# EAGLE design Principal (EAGLE 6.2)
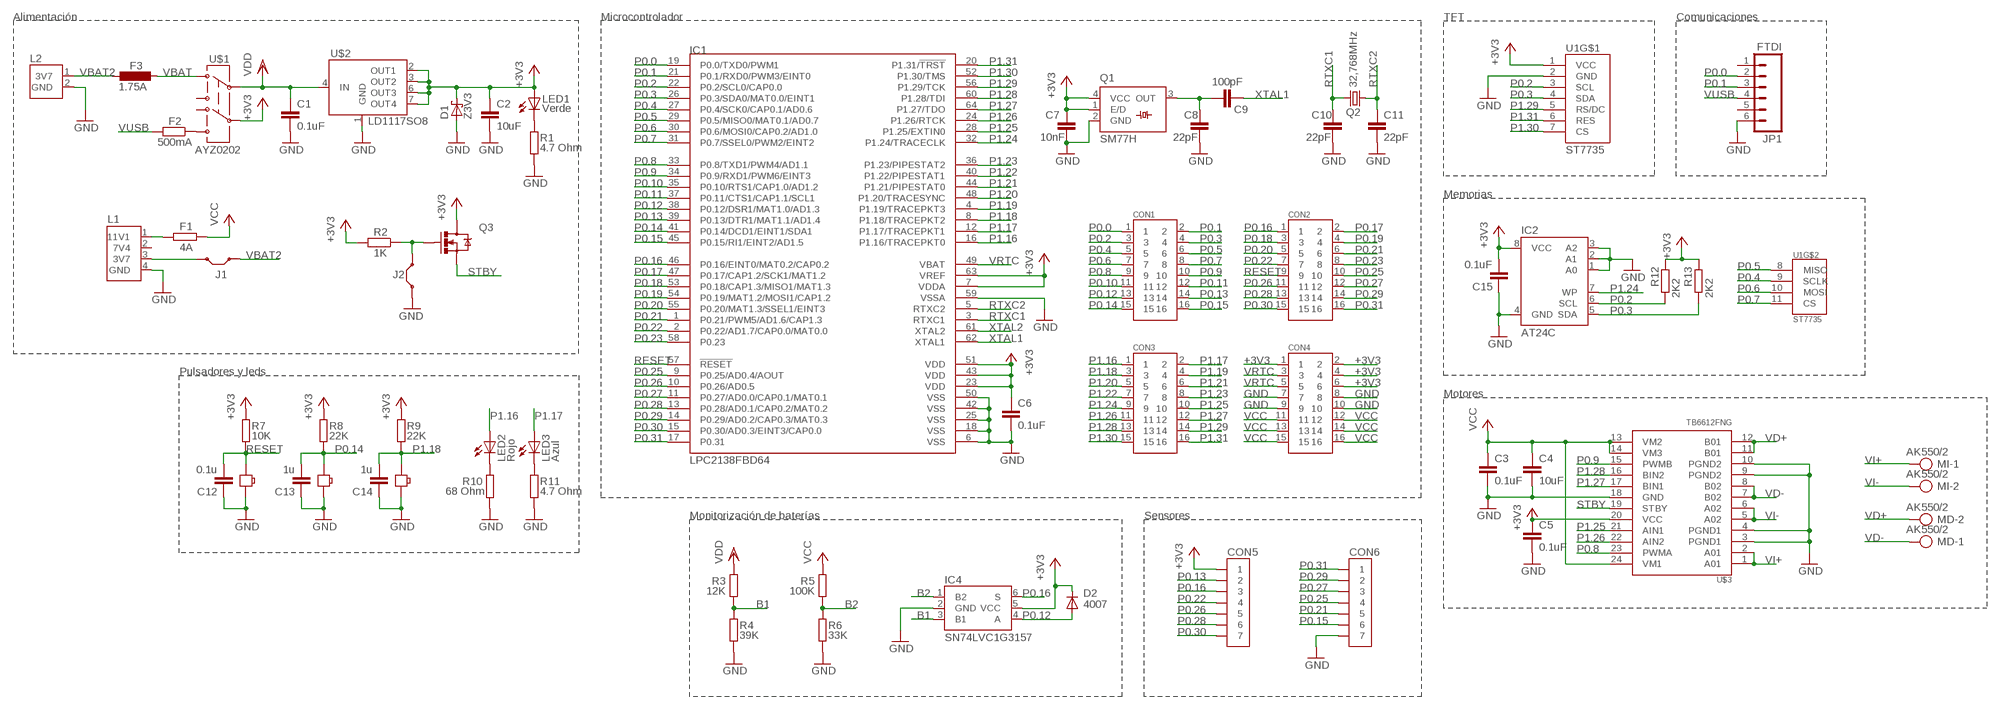
[diagram p0: schematic, sheet 1]

## Parts
B1  BUTTON-SMD-2P  [BUTTON_2P_SMD]
C1  0.1uF  C-EUC0805  [C0805]
C2  10uF  C-EUC1206  [C1206]
C3  0.1uF  C-EUC0805  [C0805]
C4  10uF  C-EUC1206  [C1206]
C5  0.1uF  C-EUC0805  [C0805]
C6  0.1uF  C-EUC0805  [C0805]
C7  10nF  C-EUC0805  [C0805]
C8  22pF  C-EUC0805  [C0805]
C9  100pF  C-EUC0805  [C0805]
C10  22pF  C-EUC0805  [C0805]
C11  22pF  C-EUC0805  [C0805]
C12  0.1u  C-EUC0805  [C0805]
C13  1u  C-EUC0805  [C0805]
C14  1u  C-EUC0805  [C0805]
C15  0.1uF  C-EUC0805  [C0805]
CON1  8X2_PIN_2MM_HEMBRA  [8X2_PIN_2MM]
CON2  8X2_PIN_2MM_HEMBRA  [8X2_PIN_2MM]
CON3  8X2_PIN_2MM_HEMBRA  [8X2_PIN_2MM]
CON4  8X2_PIN_2MM_HEMBRA  [8X2_PIN_2MM]
CON5  7_PINES  [7_PIN_MACHO_SMD_RA]
CON6  7_PINES  [7_PIN_MACHO_SMD_RA]
D1  Z3V3  SCHOTTKY-DIODEDO35-7  [DO35-7]
D2  4007  DIODE-SOD106-R  [SOD106-R]
F1  4A  FUSIBLE  [2920]
F2  500mA  R-EU_M1206  [M1206]
F3  1.75A  L-EUL1812  [L1812]
IC1  LPC2138FBD64  [TSQFP50P1200X1200X160-64N]
IC2  AT24C  [8S1]
IC4  SN74LVC1G3157  [DBV]
J1  JUMPERSMD  [2_PIN_VERT_SMD]
J2  JUMPERSMD  [2_PIN_VERT_SMD]
JP1  FTDI  M06SMD-STRAIGHT  [1X06_SMD_STRAIGHT]
L1  CONECTOR_LIPO_11.1V  [CONECTOR_LIPO_11.1V]
L2  CONECTOR_LIPO_3.7V  [CONECTOR_LIPO_3.7V]
LED1  Verde  LEDCHIPLED_0805  [CHIPLED_0805]
LED2  Rojo  LEDCHIPLED_0805  [CHIPLED_0805]
LED3  Azul  LEDCHIPLED_0805  [CHIPLED_0805]
LOAD  BUTTON-SMD-2P  [BUTTON_2P_SMD]
MD  AK550/2  [AK550/2]
MI  AK550/2  [AK550/2]
Q1  SM77H  [SM77H]
Q2  32,768MHz  CRYSTALTC38H  [TC38H]
Q3  MOSFET-NCHANNELSMD  [SOT23-3]
R1  4.7 Ohm  R-EU_R0805  [R0805]
R2  1K  R-EU_R0805  [R0805]
R3  12K  R-EU_R0805  [R0805]
R4  39K  R-EU_R0805  [R0805]
R5  100K  R-EU_R0805  [R0805]
R6  33K  R-EU_R0805  [R0805]
R7  10K  R-EU_R0805  [R0805]
R8  22K  R-EU_R0805  [R0805]
R9  22K  R-EU_R0805  [R0805]
R10  68 Ohm  R-EU_R0805  [R0805]
R11  4.7 Ohm  R-EU_R0805  [R0805]
R12  2K2  R-EU_R0805  [R0805]
R13  2K2  R-EU_R0805  [R0805]
RESET  BUTTON-SMD-2P  [BUTTON_2P_SMD]
U1  ST7735  [ST7735]
U$1  AYZ0202  [AYZ0202]
U$2  LD1117SO8  [SO8]
U$3  TB6612FNG  [SSOP24]

## Nets
+3V3: C2.1 C5.1 C6.1 C7.1 C15.2 CON4.1 CON4.2 CON4.4 CON4.6 CON5.P$1 D1.C D2.C IC1.7(VDDA) IC1.23(VDD) IC1.43(VDD) IC1.51(VDD) IC1.63(VREF) IC2.8(VCC) IC4.5(VCC) LED1.A Q1.1(E/D) Q1.4(VCC) Q3.3(D) R2.2 R7.2 R8.2 R9.2 R12.2 R13.2 U1.1(VCC) U$1.5 U$2.2(OUT1) U$2.3(OUT2) U$2.6(OUT3) U$2.7(OUT4) U$3.20(VCC)
B1: IC4.3(B1) R3.1 R4.2
B2: IC4.1(B2) R5.1 R6.2
GND [gnd]: B1.P$2 C1.2 C2.2 C3.2 C4.2 C5.2 C6.2 C7.2 C8.2 C10.2 C11.2 C12.1 C13.1 C14.1 C15.1 CON4.7 CON4.8 CON4.9 CON4.10 CON6.P$7 D1.A IC1.6(VSS) IC1.18(VSS) IC1.25(VSS) IC1.42(VSS) IC1.50(VSS) IC1.59(VSSA) IC2.1(A0) IC2.2(A1) IC2.3(A2) IC2.4(GND) IC4.2(GND) J2.1 JP1.6 L1.4(GND) L2.2(GND) LOAD.P$2 Q1.2(GND) R1.2 R4.1 R6.1 R10.2 R11.2 RESET.P$2 U1.2(GND) U$2.1(GND) U$3.3(PGND1) U$3.4(PGND1) U$3.9(PGND2) U$3.10(PGND2) U$3.18(GND)
N$1: LED2.C R10.1
N$2: LED3.C R11.1
N$3: J2.2 Q3.1(G) R2.1
N$4: F2.1 U$1.4
N$5: F1.1 L1.1(11V1)
N$6: J1.2 L1.3(3V7)
N$9: LED1.C R1.1
N$17: C8.1 C9.1 Q1.3(OUT)
P0.0: CON1.1 IC1.19(P0.0/TXD0/PWM1) JP1.2
P0.1: CON1.2 IC1.21(P0.1/RXD0/PWM3/EINT0) JP1.3
P0.2: CON1.3 IC1.22(P0.2/SCL0/CAP0.0) IC2.6(SCL) R12.1 U1.3(SCL)
P0.3: CON1.4 IC1.26(P0.3/SDA0/MAT0.0/EINT1) IC2.5(SDA) R13.1 U1.4(SDA)
P0.4: CON1.5 IC1.27(P0.4/SCK0/CAP0.1/AD0.6) U1.9(SCLK)
P0.5: CON1.6 IC1.29(P0.5/MISO0/MAT0.1/AD0.7) U1.8(MISO)
P0.6: CON1.7 IC1.30(P0.6/MOSI0/CAP0.2/AD1.0) U1.10(MOSI)
P0.7: CON1.8 IC1.31(P0.7/SSEL0/PWM2/EINT2) U1.11(CS)
P0.8: CON1.9 IC1.33(P0.8/TXD1/PWM4/AD1.1) U$3.23(PWMA)
P0.9: CON1.10 IC1.34(P0.9/RXD1/PWM6/EINT3) U$3.15(PWMB)
P0.10: CON1.11 IC1.35(P0.10/RTS1/CAP1.0/AD1.2)
P0.11: CON1.12 IC1.37(P0.11/CTS1/CAP1.1/SCL1)
P0.12: CON1.13 D2.A IC1.38(P0.12/DSR1/MAT1.0/AD1.3) IC4.4(A)
P0.13: CON1.14 CON5.P$2 IC1.39(P0.13/DTR1/MAT1.1/AD1.4)
P0.14: C13.2 CON1.15 IC1.41(P0.14/DCD1/EINT1/SDA1) LOAD.1 R8.1
P0.15: CON1.16 CON6.P$6 IC1.45(P0.15/RI1/EINT2/AD1.5)
P0.16: CON2.1 CON5.P$3 IC1.46(P0.16/EINT0/MAT0.2/CAP0.2) IC4.6(S)
P0.17: CON2.2 IC1.47(P0.17/CAP1.2/SCK1/MAT1.2)
P0.18: CON2.3 IC1.53(P0.18/CAP1.3/MISO1/MAT1.3)
P0.19: CON2.4 IC1.54(P0.19/MAT1.2/MOSI1/CAP1.2)
P0.20: CON2.5 IC1.55(P0.20/MAT1.3/SSEL1/EINT3)
P0.21: CON2.6 CON6.P$5 IC1.1(P0.21/PWM5/AD1.6/CAP1.3)
P0.22: CON2.7 CON5.P$4 IC1.2(P0.22/AD1.7/CAP0.0/MAT0.0)
P0.23: CON2.8 IC1.58(P0.23)
P0.25: CON2.10 CON6.P$4 IC1.9(P0.25/AD0.4/AOUT)
P0.26: CON2.11 CON5.P$5 IC1.10(P0.26/AD0.5)
P0.27: CON2.12 CON6.P$3 IC1.11(P0.27/AD0.0/CAP0.1/MAT0.1)
P0.28: CON2.13 CON5.P$6 IC1.13(P0.28/AD0.1/CAP0.2/MAT0.2)
P0.29: CON2.14 CON6.P$2 IC1.14(P0.29/AD0.2/CAP0.3/MAT0.3)
P0.30: CON2.15 CON5.P$7 IC1.15(P0.30/AD0.3/EINT3/CAP0.0)
P0.31: CON2.16 CON6.P$1 IC1.17(P0.31)
P1.16: CON3.1 IC1.16(P1.16/TRACEPKT0) LED2.A
P1.17: CON3.2 IC1.12(P1.17/TRACEPKT1) LED3.A
P1.18: B1.1 C14.2 CON3.3 IC1.8(P1.18/TRACEPKT2) R9.1
P1.19: CON3.4 IC1.4(P1.19/TRACEPKT3)
P1.20: CON3.5 IC1.48(P1.20/TRACESYNC)
P1.21: CON3.6 IC1.44(P1.21/PIPESTAT0)
P1.22: CON3.7 IC1.40(P1.22/PIPESTAT1)
P1.23: CON3.8 IC1.36(P1.23/PIPESTAT2)
P1.24: CON3.9 IC1.32(P1.24/TRACECLK) IC2.7(WP)
P1.25: CON3.10 IC1.28(P1.25/EXTIN0) U$3.21(AIN1)
P1.26: CON3.11 IC1.24(P1.26/RTCK) U$3.22(AIN2)
P1.27: CON3.12 IC1.64(P1.27/TDO) U$3.17(BIN1)
P1.28: CON3.13 IC1.60(P1.28/TDI) U$3.16(BIN2)
P1.29: CON3.14 IC1.56(P1.29/TCK) U1.5(RS/DC)
P1.30: CON3.15 IC1.52(P1.30/TMS) U1.7(CS)
P1.31: CON3.16 IC1.20(P1.31/!TRST) U1.6(RES)
RESET: C12.2 CON2.9 IC1.57(!RESET) R7.1 RESET.1
RTXC1: C10.1 IC1.3(RTXC1) Q2.2
RTXC2: C11.1 IC1.5(RTXC2) Q2.1
STBY: Q3.2(S) U$3.19(STBY)
VBAT: F3.1 U$1.3
VBAT2: F3.2 J1.1 L2.1(3V7)
VCC: C3.1 C4.1 CON4.11 CON4.12 CON4.13 CON4.14 CON4.15 CON4.16 F1.2 R5.2 U$3.13(VM2) U$3.14(VM3) U$3.24(VM1)
VD+: MD.2 U$3.11(B01) U$3.12(B01)
VD-: MD.1 U$3.7(B02) U$3.8(B02)
VDD: C1.1 R3.2 U$1.2 U$2.4(IN)
VI+: MI.1 U$3.1(A01) U$3.2(A01)
VI-: MI.2 U$3.5(A02) U$3.6(A02)
VRTC: CON4.3 CON4.5 IC1.49(VBAT)
VUSB: F2.2 JP1.4
XTAL1: C9.2 IC1.62(XTAL1)
XTAL2: IC1.61(XTAL2)
Unconnected: JP1.1 JP1.5 U$1.1 U$1.6

## Notes on the sheet
- Alimentación | Microcontrolador | TFT | Comunicaciones
- Memorias
- Pulsadores y leds
- Motores
- Monitorización de baterías | Sensores

## Power pins joined to a net without a drawn wire
7V4: L1.2(7V4)

## Library data of the parts
B1 LOAD RESET = Itead_BP_110825:BUTTON-SMD-2P: BAS014
C1-C15 = resistor:C-EU: CAPACITOR, European symbol
CON1-CON4 = Robots:8X2_PIN_2MM_HEMBRA
CON5 CON6 = Robots:7_PINES
D1 = diode:SCHOTTKY-DIODE: Schottky Diode
D2 = diode:DIODE-: DIODE
F1 = Robots:FUSIBLE
F2 R1-R13 = resistor:R-EU_: RESISTOR, European symbol
F3 = resistor:L-EU: INDUCTOR, European symbol
IC1 = nxp:LPC2138
IC2 = atmel:AT24C*: 2-wire serial EEPROM
IC4 = Robots:SN74LVC1G3157
J1 J2 = Robots:JUMPER
JP1 = SparkFun:M06: Header 6 Standard 6-pin 0.1" header. Use with straight break away headers (SKU : PRT-00116), right angle break away headers (PRT-00553), swiss pins (PRT-00743), machine pins (PRT-00117), and female headers (PRT-00115). Molex polarized connector foot print use with SKU : PRT-08094 with associated crimp pins and housings. NOTES ON THE VARIANTS LOCK and LOCK_LONGPADS... This footprint was designed to help hold the alignment of a through-hole component (i.e. 6-pin header) while soldering it into place. You may notice that each hole has been shifted either up or down by 0.005 of an inch from it's more standard position (which is a perfectly straight line). This slight alteration caused the pins (the squares in the middle) to touch the edges of the holes. Because they are alternating, it causes a "brace" to hold the component in place. 0.005 has proven to be the perfect amount of "off-center" position when using our standard breakaway headers. Although looks a little odd when you look at the bare footprint, once you have a header in there, the alteration is very hard to notice. Also, if you push a header all the way into place, it is covered up entirely on the bottom side. This idea of altering the position of holes to aid alignment will be further integrated into the Sparkfun Library for other footprints. It can help hold any component with 3 or more connection pins.
L1 = Robots:CONECTOR_LIPO_11.1V
L2 = Robots:CONECTOR_LIPO_3.7V
LED1-LED3 = led:LED: LED OSRAM: - CHIPLED LG R971, LG N971, LY N971, LG Q971, LY Q971, LO R971, LY R971 LH N974, LH R974 LS Q976, LO Q976, LY Q976 LO Q996 - Hyper CHIPLED LW Q18S LB Q993, LB Q99A, LB R99A - SideLED LS A670, LO A670, LY A670, LG A670, LP A670 LB A673, LV A673, LT A673, LW A673 LH A674 LY A675 LS A676, LA A676, LO A676, LY A676, LW A676 LS A679, LY A679, LG A679 - Hyper Micro SIDELED® LS Y876, LA Y876, LO Y876, LY Y876 LT Y87S - SmartLED LW L88C, LW L88S LB L89C, LB L89S, LG L890 LS L89K, LO L89K, LY L89K LS L896, LA L896, LO L896, LY L896 - TOPLED LS T670, LO T670, LY T670, LG T670, LP T670 LSG T670, LSP T670, LSY T670, LOP T670, LYG T670 LG T671, LOG T671, LSG T671 LB T673, LV T673, LT T673, LW T673 LH T674 LS T676, LA T676, LO T676, LY T676, LB T676, LH T676, LSB T676, LW T676 LB T67C, LV T67C, LT T67C, LS T67K, LO T67K, LY T67K, LW E67C LS E67B, LA E67B, LO E67B, LY E67B, LB E67C, LV E67C, LT E67C LW T67C LS T679, LY T679, LG T679 LS T770, LO T770, LY T770, LG T770, LP T770 LB T773, LV T773, LT T773, LW T773 LH T774 LS E675, LA E675, LY E675, LS T675 LS T776, LA T776, LO T776, LY T776, LB T776 LHGB T686 LT T68C, LB T68C - Hyper Mini TOPLED® LB M676 - Mini TOPLED Santana® LG M470 LS M47K, LO M47K, LY M47K Source: http://www.osram.convergy.de LUXEON: - LUMILED® LXK2-PW12-R00, LXK2-PW12-S00, LXK2-PW14-U00, LXK2-PW14-V00 LXK2-PM12-R00, LXK2-PM12-S00, LXK2-PM14-U00 LXK2-PE12-Q00, LXK2-PE12-R00, LXK2-PE12-S00, LXK2-PE14-T00, LXK2-PE14-U00 LXK2-PB12-K00, LXK2-PB12-L00, LXK2-PB12-M00, LXK2-PB14-N00, LXK2-PB14-P00, LXK2-PB14-Q00 LXK2-PR12-L00, LXK2-PR12-M00, LXK2-PR14-Q00, LXK2-PR14-R00 LXK2-PD12-Q00, LXK2-PD12-R00, LXK2-PD12-S00 LXK2-PH12-R00, LXK2-PH12-S00 LXK2-PL12-P00, LXK2-PL12-Q00, LXK2-PL12-R00 Source: www.luxeon.com KINGBRIGHT: KA-3528ASYC Source: www.kingbright.com
MD MI = con-ptr500:AK550/2: CONNECTOR; OC_FARNELL: unknown; OC_NEWARK: unknown
Q1 = crystal:SM77H: 3.3V CMOS Clock Oscillator Source: www.pletronics.com .. sm77h%203.3v.pdf; OC_FARNELL: unknown; OC_NEWARK: unknown
Q2 = crystal:CRYSTAL: CRYSTAL; OC_FARNELL: unknown; OC_NEWARK: unknown
Q3 = SparkFun:MOSFET-NCHANNEL
U1 = Robots:ST7735
U$1 = SparkFun:AYZ0202: SPDT Slide Switch Simple SMD single-pull double-throw slide switch. Good for less than 350mA power switch, switching UARTs between devices, etc. Spark Fun Electronics SKU : COM-00597
U$2 = Robots:LD1117SO8
U$3 = SparkFun:TB6612FNG: Toshiba 1A motor driver

## Board
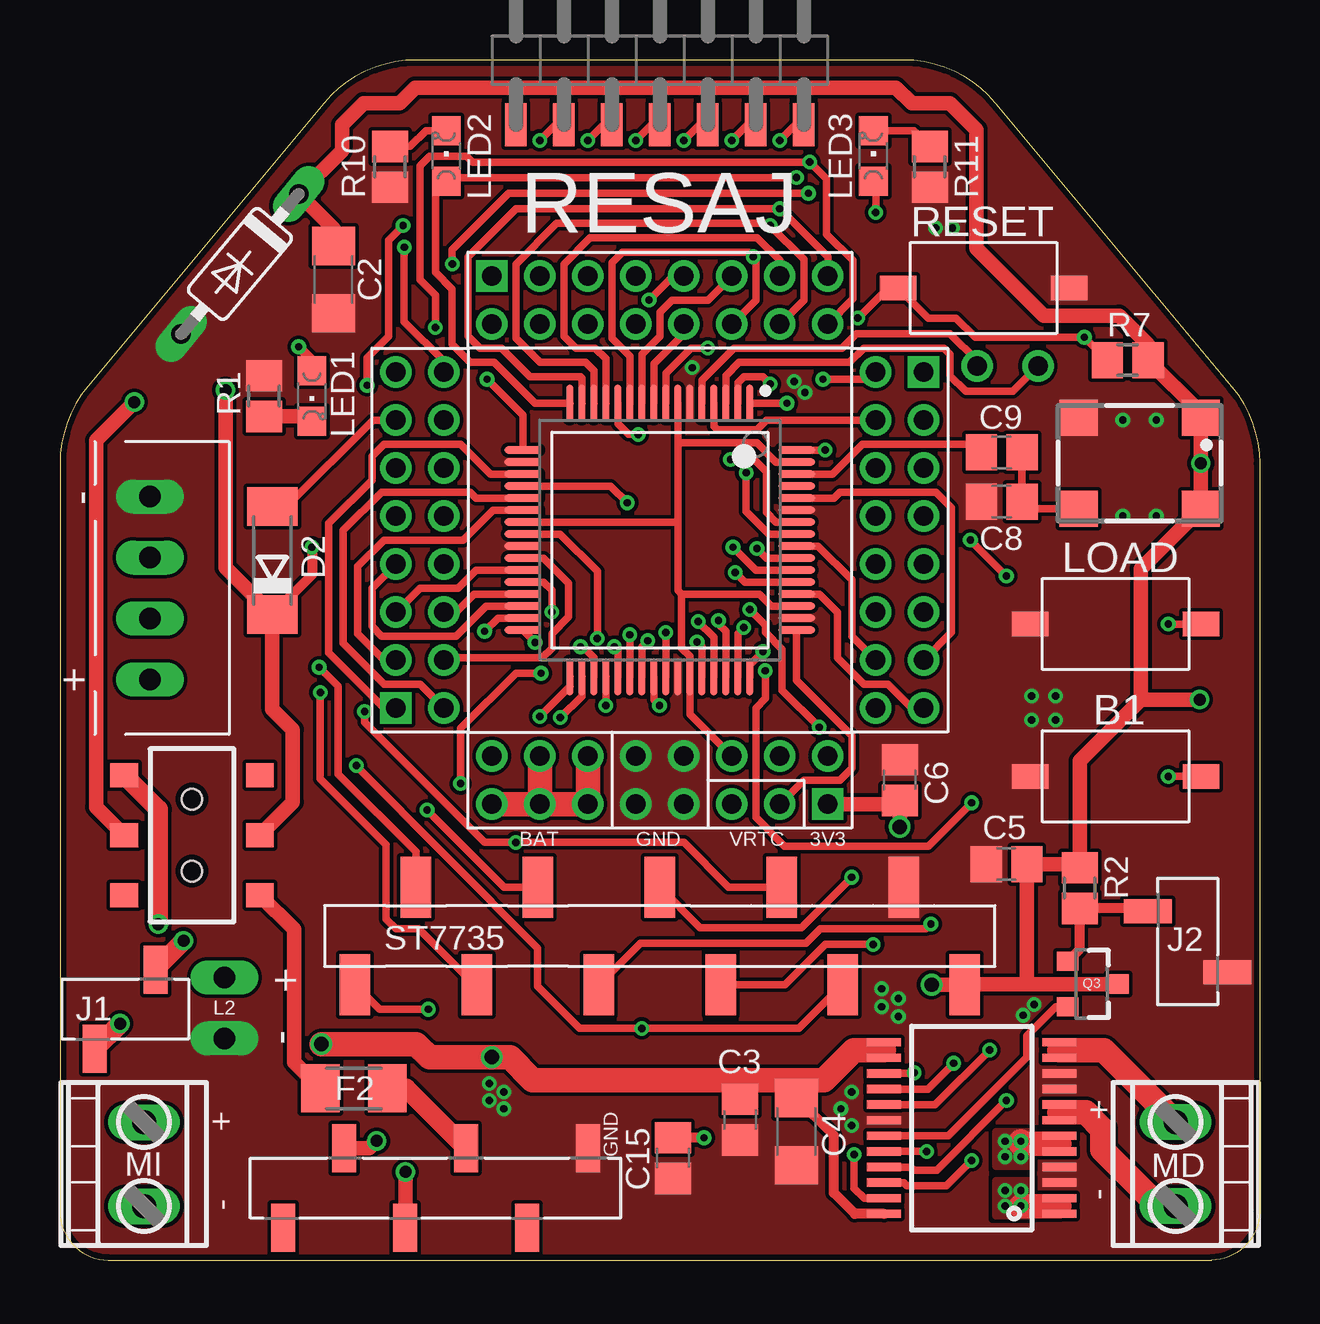
[diagram p1: board, top side]
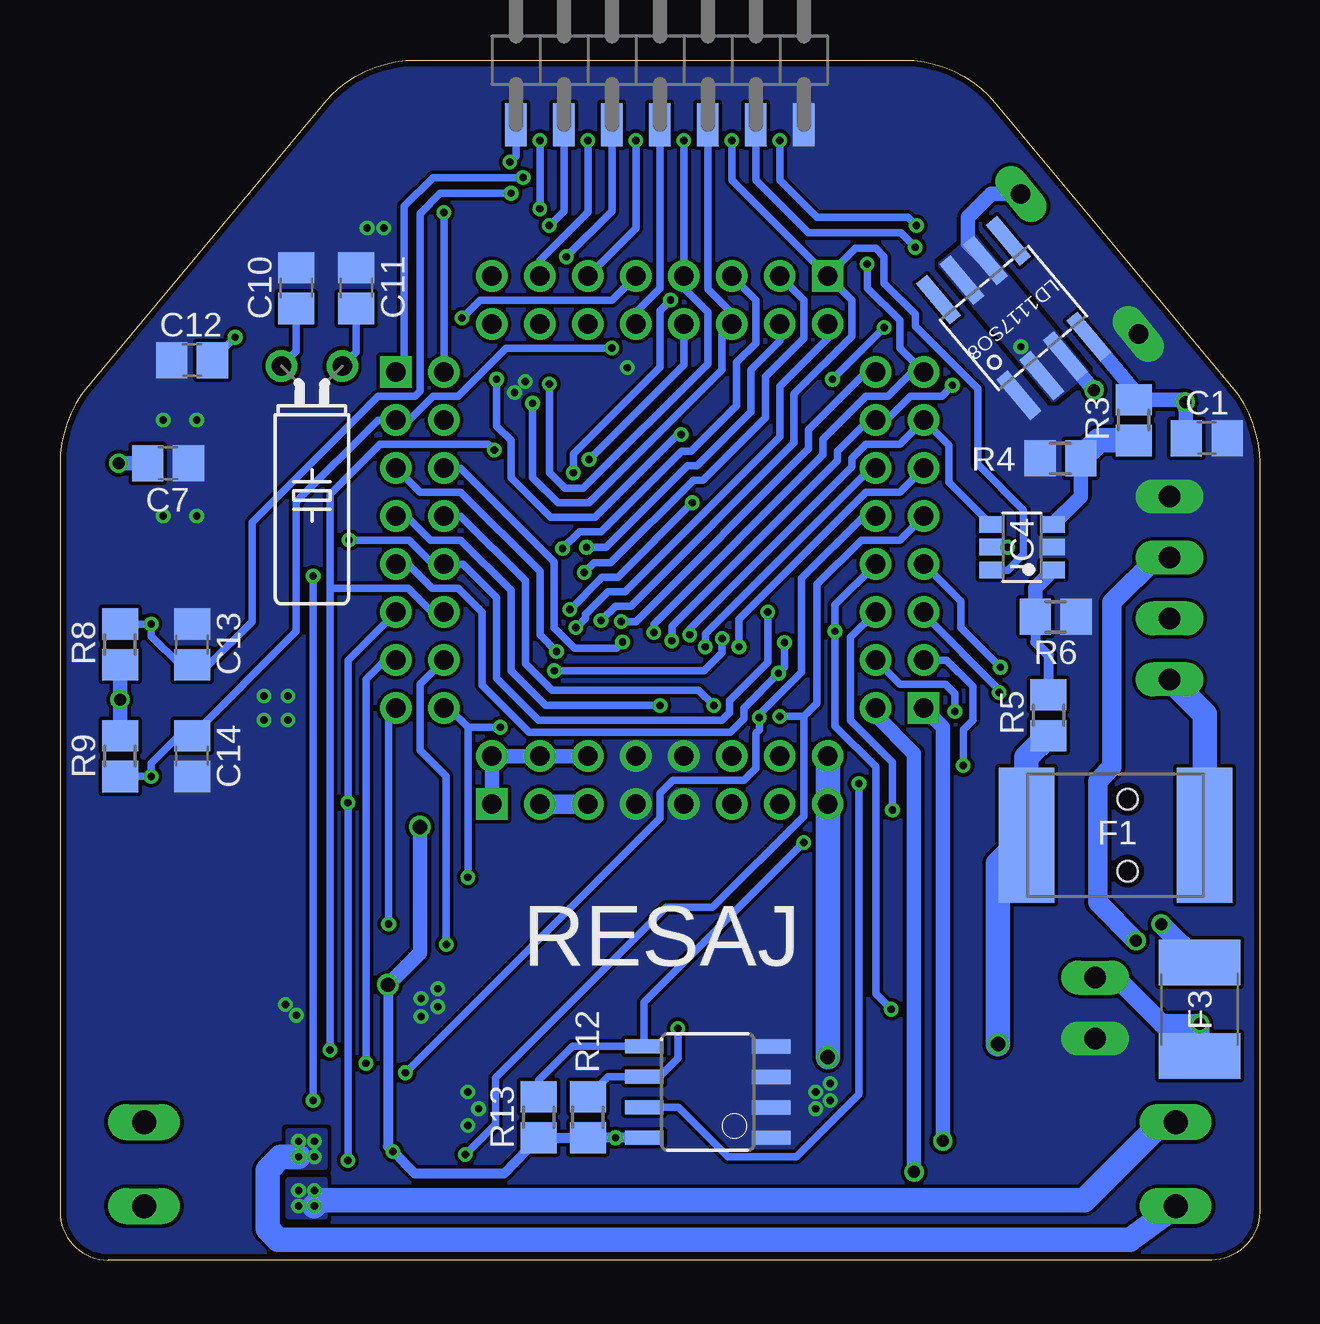
[diagram p2: board, bottom side, seen from below]

Size 50 x 50 mm. Coordinates in mm from the lower left corner, seen from the top.
Outline: 50,33.19 50,2 arc-90 48,0 2,0 arc-90 0,2 0,33.19 arc-40 1.16,36.39 11,48.2 arc-50 14.84,50 35.16,50 arc-50 39,48.2 48.84,36.39 arc-40 50,33.19
Copper layers (1*16): Top 0.035mm / dielectric 1.5mm / Bottom 0.035mm
Design rules: minimum track width 6mil, minimum drill 12mil, track to track 6mil, track to pad 6mil, pad to pad 6mil, via to via 6mil, smd to smd 0mil, copper to edge 10mil, drill to drill 10mil, minimum pad ring 10mil, minimum via ring 6mil, stop-mask expansion 2mil, vias tented up to drill 100mil, thermal gap 10mil

### Footprints (pad centres in the part's own frame; a part is rotated, then mirrored left to right if it is on the bottom)
BUTTON_2P_SMD = smd 1.524 x 1.016: 1 -3.556,0; P$2 3.556,0
C0805 = smd 1.3 x 1.5: 1 -0.85,0; 2 0.85,0
C1206 = smd 1.6 x 1.8: 1 -1.4,0; 2 1.4,0
8X2_PIN_2MM = drill 0.8 square: 1 0,0 | drill 0.8: 2 0,-2; 3 2,0; 4 2,-2; 5 4,0; 6 4,-2; 7 6,0; 8 6,-2; 9 8,0; 10 8,-2; 11 10,0; 12 10,-2; 13 12,0; 14 12,-2; 15 14,0; 16 14,-2
7_PIN_MACHO_SMD_RA = smd 0.914 x 1.778: P$1 1,-1.7; P$2 3,-1.7; P$3 5,-1.7; P$4 7,-1.7; P$5 9,-1.7; P$6 11,-1.7; P$7 13,-1.7
DO35-7 = drill 0.813 long: A 3.81,0; C -3.81,0
SOD106-R = smd 1.6 x 2.1: A 2.25,0; C -2.25,0
2920 = smd 2.311 x 5.613: 1 -3.708,0; 2 3.708,0
M1206 = smd 1.6 x 2: 1 -1.4,0; 2 1.4,0
L1812 = smd 1.9 x 3.4: 1 -1.95,0; 2 1.95,0
TSQFP50P1200X1200X160-64N = smd 1.55 x 0.3: 1 -5.7,3.75; 2 -5.7,3.25; 3 -5.7,2.75; 4 -5.7,2.25; 5 -5.7,1.75; 6 -5.7,1.25; 7 -5.7,0.75; 8 -5.7,0.25; 9 -5.7,-0.25; 10 -5.7,-0.75; 11 -5.7,-1.25; 12 -5.7,-1.75; 13 -5.7,-2.25; 14 -5.7,-2.75; 15 -5.7,-3.25; 16 -5.7,-3.75; 33 5.7,-3.75; 34 5.7,-3.25; 35 5.7,-2.75; 36 5.7,-2.25; 37 5.7,-1.75; 38 5.7,-1.25; 39 5.7,-0.75; 40 5.7,-0.25; 41 5.7,0.25; 42 5.7,0.75; 43 5.7,1.25; 44 5.7,1.75; 45 5.7,2.25; 46 5.7,2.75; 47 5.7,3.25; 48 5.7,3.75 | smd 0.3 x 1.55: 17 -3.75,-5.7; 18 -3.25,-5.7; 19 -2.75,-5.7; 20 -2.25,-5.7; 21 -1.75,-5.7; 22 -1.25,-5.7; 23 -0.75,-5.7; 24 -0.25,-5.7; 25 0.25,-5.7; 26 0.75,-5.7; 27 1.25,-5.7; 28 1.75,-5.7; 29 2.25,-5.7; 30 2.75,-5.7; 31 3.25,-5.7; 32 3.75,-5.7; 49 3.75,5.7; 50 3.25,5.7; 51 2.75,5.7; 52 2.25,5.7; 53 1.75,5.7; 54 1.25,5.7; 55 0.75,5.7; 56 0.25,5.7; 57 -0.25,5.7; 58 -0.75,5.7; 59 -1.25,5.7; 60 -1.75,5.7; 61 -2.25,5.7; 62 -2.75,5.7; 63 -3.25,5.7; 64 -3.75,5.7
8S1 = smd 0.6 x 1.6: 1 -1.905,-2.654; 2 -0.645,-2.654; 3 0.625,-2.654; 4 1.895,-2.654; 5 1.905,2.654; 6 0.635,2.654; 7 -0.635,2.654; 8 -1.905,2.654
DBV = smd 0.69 x 0.99: 1 -0.95,-1.29; 2 0,-1.29; 3 0.95,-1.29; 4 0.95,1.29; 5 0,1.29; 6 -0.95,1.29
2_PIN_VERT_SMD = smd 1 x 2: 1 0,1.65; 2 -2.54,-1.65
1X06_SMD_STRAIGHT = smd 1 x 2: 1 0,1.65; 2 -2.54,-1.65; 3 -5.08,1.65; 4 -7.62,-1.65; 5 -10.16,1.65; 6 -12.7,-1.65
CONECTOR_LIPO_11.1V = drill 0.9 long: 1 3.81,0; 2 1.27,0; 3 -1.27,0; 4 -3.81,0
CONECTOR_LIPO_3.7V = drill 0.9 long: 1 1.27,0; 2 -1.27,0
CHIPLED_0805 = smd 1.2 x 1.2: A 0,-1.05; C 0,1.05
AK550/2 = drill 1 pad 1.5 long: 1 -1.75,0; 2 1.75,0
SM77H = smd 1.6 x 1.5: 1 -2.55,-1.9; 2 2.55,-1.9; 3 2.55,1.9; 4 -2.55,1.9
TC38H = drill 0.813: 1 -1.27,0; 2 1.27,0
SOT23-3 = smd 0.8 x 0.9: 1 -0.95,-1; 2 0.95,-1; 3 0,1.1
R0805 = smd 1.3 x 1.5: 1 -0.85,0; 2 0.85,0
ST7735 = smd 1.27 x 2.54: 1 12.7,-2.032; 2 10.16,2.032; 3 7.62,-2.032; 4 5.08,2.032; 5 2.54,-2.032; 6 0,2.032; 7 -2.54,-2.032; 8 -5.08,2.032; 9 -7.62,-2.032; 10 -10.16,2.032; 11 -12.7,-2.032
AYZ0202 = smd 1 x 1.15: 1 -2.5,2.825; 2 0,2.825; 3 2.5,2.825; 4 -2.5,-2.825; 5 0,-2.825; 6 2.5,-2.825 | hole 0.85: 1.5,0; -1.5,0
SO8 = smd 0.6 x 2.2: 1 -1.905,-2.6; 2 -0.635,-2.6; 3 0.635,-2.6; 4 1.905,-2.6; 5 1.905,2.6; 6 0.635,2.6; 7 -0.635,2.6; 8 -1.905,2.6
SSOP24 = smd 0.348 x 1.397: 1 -3.575,-3.656; 2 -2.925,-3.656; 3 -2.275,-3.656; 4 -1.625,-3.656; 5 -0.975,-3.656; 6 -0.325,-3.656; 7 0.325,-3.656; 8 0.975,-3.656; 9 1.625,-3.656; 10 2.275,-3.656; 11 2.925,-3.656; 12 3.575,-3.656; 13 3.575,3.656; 14 2.925,3.656; 15 2.275,3.656; 16 1.625,3.656; 17 0.975,3.656; 18 0.325,3.656; 19 -0.325,3.656; 20 -0.975,3.656; 21 -1.625,3.656; 22 -2.275,3.656; 23 -2.925,3.656; 24 -3.575,3.656

### Placement (x,y rotation side)
B1  44,20.15 180 top
C1  2.2,34.25 0 bottom
C2  11.4,40.85 270 top
C3  28.35,5.85 270 top
C4  30.7,5.35 270 top
C5  39.45,16.5 180 top
C6  35,20 90 top
C7  45.5,33.2 0 bottom
C8  39.25,31.6 180 top
C9  39.25,33.65 180 top
C10  40.15,40.5 90 bottom
C11  37.65,40.5 90 bottom
C12  44.5,37.5 0 bottom
C13  44.5,25.65 270 bottom
C14  44.5,21 90 bottom
C15  25.55,4.25 90 top
CON1  14,23 90 top
CON2  18,41 0 top
CON3  36,37 270 top
CON4  32,19 180 top
CON5  18,49 0 top
CON6  32,49 0 bottom
D1  7.5,41.5 230 top
D2  8.85,29.15 90 top
F1  6,17.7 180 bottom
F2  12.25,7.15 0 top
F3  2.5,10.45 270 bottom
IC1  25,30 270 top
IC2  23,7 90 bottom
IC4  9.9,29.7 90 bottom
J1  1.45,10.45 180 top
J2  47,12 270 top
JP1  9.3,3 180 top
L1  3.75,28 270 top
L2  6.85,10.5 90 top
LED1  10.5,36 180 top
LED2  16.1,46 0 top
LED3  33.9,46 0 top
LOAD  44,26.5 180 top
MD  46.5,4 90 top
MI  3.5,4 270 top
Q1  45,33.2 180 top
Q2  39.5,37.25 180 bottom
Q3  43,11.5 270 top
R1  8.5,36 90 top
R2  42.5,15.5 90 top
R3  5.25,35 90 bottom
R4  8.3,33.4 0 bottom
R5  8.8,22.7 270 bottom
R6  8.5,26.8 180 bottom
R7  44.5,37.5 0 top
R8  47.5,25.65 270 bottom
R9  47.5,21 90 bottom
R10  13.75,45.55 270 top
R11  36.25,45.55 270 top
R12  28,5.95 270 bottom
R13  30.05,5.95 270 bottom
RESET  38.5,40.5 0 top
U1  25,13.5 0 top
U$1  5.5,17.7 90 top
U$2  10.25,39.25 40 bottom
U$3  38,5.5 90 top

### Tracks (layer width: path | path; a pad name or v marks a point on that pad's centre or on a via)
+3V3  (via drill 0.3, 0.5, 0.6)
  Top 0.305: CON4.6 26.25,22.75 IC1.43 26.25,25.15 25.9,25.5 25.9,27.75 | 25.75,30.75 IC1.23 | 25.75,30.75 25.75,34.05 | 25.75,34.05 IC1.7 | IC1.63 29.85,33.25 29.05,34.05 25.75,34.05 | IC1.51 29.65,27.25 29.15,27.75 25.9,27.75 | 25.75,30.75 25.75,27.9 25.9,27.75 | U$3.20 v36.12,4.53
  Top 0.406: v26.84,5.09 C15.2 | v10.5,29.7 10.5,28.55 D2.C | v9.95,38.05 10.5,37.5 LED1.A
  Top 0.61: v36.33,11.47 U1.1 37.73,11.5 40.3,11.5 | 40.3,11.5 Q3.3 | 40.3,11.5 C5.1 42.35,16.5 R2.2 42.5,20.8 45.05,23.35 | v35,18.05 C6.1 34.85,19 CON4.1 | 45.05,23.35 45.05,28.8 Q1.4 v47.55,33.2 Q1.1 47.55,35.3 R7.2 45.35,38.15 44.15,39.35 41,39.35 38.2,42.15 38.2,47.1 37.1,48.2 35.5,48.2 34.85,48.85 19,48.85 | 45.05,23.35 v47.5,23.35 | U$1.5 9.7,19.07 9.7,22.1 8.85,22.95 D2.C 6.9,28.85 v6.9,36.25 | 19,48.85 14.8,48.85 14.15,48.2 12.65,48.2 11.75,47.3 11.75,46.22 D1.C 11.4,42.97 C2.1 | CON5.P$1 19,48.85
  Bottom 0.406: v36.33,11.47 36.33,4.73 v36.12,4.53 35.2,3.6 31.5,3.6 R13.2 R12.2 v26.84,5.09 IC2.8 | v10.5,29.7 IC4.5
  Bottom 0.61: CON4.6 CON4.4 CON4.2 CON4.1 | v35,18.05 35,12.8 v36.33,11.47 | R9.2 v47.5,23.35 R8.2 | U$2.6 12.15,42.37 12.15,43.45 11.18,44.42 D1.C | C7.1 v47.55,33.2 | U$2.3 v6.9,36.25
  pour Bottom (no thermals): 11.9,42.7 7.15,37 8.6,35.8 13.35,41.5
B1
  Bottom 0.61: R4.2 7.45,31.81 IC4.3
  Bottom 1.016: R3.1 6.7,34.15 R4.2
B2
  Bottom 0.406: R6.2 9.35,25.75 8.8,25.2 R5.1
  Bottom 0.61: R6.2 9.35,28.01 IC4.1
GND  (via drill 0.3)
  other vias: 26.36,37.18 30.6,36.6 31.05,36.15 17.9,7.35 18.5,7 17.9,6.65 18.5,6.3 41.5,23.5 40.5,23.5 45.7,35 44.3,35 44.3,31 45.7,31 36.5,43 37.2,43 40.6,10.65 40.15,10.2 33,7 33,5.6 32.55,6.3 34.95,10.15 34.95,10.9 34.25,10.55 34.25,11.3 41.5,22.5 40.5,22.5
  pour Bottom (rank 2, no thermals): 0,33.19 0,2 arc90 2,0 48,0 arc90 50,2 50,33.19 arc40 48.84,36.39 39,48.2 arc50 35.16,50 14.84,50 arc50 11,48.2 1.16,36.39 arc40
  pour Top (rank 2, no thermals): 0,33.19 0,2 arc90 2,0 48,0 arc90 50,2 50,33.19 arc40 48.84,36.39 39,48.2 arc50 35.16,50 14.84,50 arc50 11,48.2 1.16,36.39 arc40
N$1
  Top 0.305: R10.1 14.6,46.4 15.25,47.05 LED2.C
N$2
  Top 0.305: LED3.C 35.6,47.05 R11.1
N$3
  Top 0.406: Q3.1 42.5,12.95 R2.1 45.24,14.65 J2.2
N$4
  Top 0.61: U$1.4 9.75,13.78 9.75,8.25 F2.1
N$5
  Bottom 1.016: F1.1 2.29,22.73 L1.1
N$6  (via drill 0.5)
  Top 0.813: v5.15,13.3 3.99,12.14 J1.2
  Bottom 0.813: L1.3 4.28,29.27 6.15,27.4 6.15,20.55 6.75,19.95 6.75,14.9 v5.15,13.3
N$9
  Top 0.61: R1.1 10.3,35.15 LED1.C
N$17
  Top 0.305: C9.1 C8.1 40.4,31.3 Q1.3
P0.0  (via drill 0.5)
  Top 0.305: CON1.1 13.5,23 11.2,25.3 11.2,30.7 13,32.5 13,33.5 13.5,34 16.7,34 17.95,32.75 IC1.19
  Top 0.61: JP1.2 12.89,4.65 v13.2,4.96
  Bottom 0.61: v13.2,4.96 13.2,22.2 CON1.1
P0.1  (via drill 0.5)
  Top 0.305: CON1.2 15,24 13.5,24 11.8,25.7 11.8,30.4 13.4,32 17.1,32 17.35,31.75 IC1.21
  Top 0.61: v14.4,3.67 14.4,1.37 JP1.3
  Bottom 0.61: CON1.2 16,22.7 14.4,21.1 v14.4,3.67
P0.2  (via drill 0.3)
  Top 0.305: CON1.3 13.5,25 12.4,26.1 12.4,28.9 13.5,30 16.8,30 18.05,31.25 IC1.22 | v12.35,20.6 19.9,13 19.9,11.4 21.65,9.65 v24.25,9.65 30.8,9.65 U1.3
  Bottom 0.305: CON1.3 13.05,25 11.95,23.9 11.95,22.5 12.35,22.1 v12.35,20.6 | v24.25,9.65 24.25,8.4 25.02,7.63 IC2.6 27.16,7.63 R12.1
P0.3  (via drill 0.3)
  Top 0.305: IC1.26 20.15,29.25 21.2,28.2 21.2,26.8 20.5,26.1 20.5,25.5 20.1,25.1 16.1,25.1 CON1.4 | U1.4 27.87,15.53 26,17.4 v19,17.4 17.7,17.4 12.7,22.4 v12.7,22.85
  Bottom 0.305: CON1.4 15,24 13.1,24 12.7,23.6 v12.7,22.85 | v19,17.4 25.65,10.75 IC2.5 28.64,8.9 30.05,7.5 R13.1
P0.4  (via drill 0.3)
  Top 0.305: CON1.5 15,28 16.6,28 17.35,28.75 IC1.27 | v10.85,23.65 10.85,20.05 13.6,17.3 13.6,14.2 14,13.8 14.95,13.8 17.28,11.47 U1.9
  Bottom 0.305: CON1.5 14,26.9 10.85,23.75 v10.85,23.65
P0.5  (via drill 0.3)
  Top 0.305: CON1.6 16.5,27 17.25,27.75 IC1.29 | v15.3,18.75 18.52,15.53 U1.8
  Bottom 0.305: CON1.6 17.05,25.95 17.05,22.5 15.3,20.75 v15.3,18.75
P0.6  (via drill 0.3)
  Top 0.305: CON1.7 13,28 13,26.4 13.4,26 16.5,26 17.75,27.25 IC1.30 | U1.10 14.84,17.01 11.6,20.25 11.6,23.9 v10.8,24.7
  Bottom 0.305: v10.8,24.7 12.45,26.35 12.45,27.45 CON1.7
P0.7  (via drill 0.3)
  Top 0.305: IC1.31 18.25,26.75 v17.7,26.2 | v15.35,10.45 13.32,10.45 U1.11
  Bottom 0.305: CON1.8 17.7,27.3 v17.7,26.2 17.7,22.25 16,20.55 16,11.1 v15.35,10.45
P0.8  (via drill 0.3)
  Top 0.305: v20,22.65 21.25,23.9 IC1.33 | v33.1,4.4 33.1,3 33.52,2.58 U$3.23
  Bottom 0.305: CON1.9 15,30 16.6,30 18.45,28.15 18.45,23.2 19,22.65 | 19,22.65 v20,22.65 | 19,22.65 19,18.5 22.8,14.7 24.75,14.7 31.85,7.6 31.85,5.65 v33.1,4.4
P0.9  (via drill 0.3)
  Top 0.305: IC1.34 21.75,23.5 v20.85,22.6 | U$3.15 35.58,7.78 v35.6,7.8
  Bottom 0.305: CON1.10 16.5,31 19.1,28.4 19.1,24.5 20.85,22.75 v20.85,22.6 20.85,22.1 21,21.95 21,20.5 21.5,20 24.45,20 25,19.45 25,18.4 v35.6,7.8
P0.10  (via drill 0.3)
  Top 0.305: IC1.35 22.25,25.1 21.8,25.55 v21.7,25.55
  Bottom 0.305: CON1.11 15,32 16.4,32 21.7,26.7 v21.7,25.55
P0.11  (via drill 0.3)
  Top 0.305: IC1.37 23.25,25.4 v23.1,25.55
  Bottom 0.305: CON1.12 16.2,33 23.1,26.1 v23.1,25.55
P0.12  (via drill 0.3)
  Top 0.305: v23.75,26.05 IC1.38 | D2.A 9.45,31.4 13.05,35 CON1.13
  Bottom 0.305: v23.75,26.05 23.75,26.3 17,33.05 17,33.4 16.4,34 15,34 CON1.13 12.95,33.95 12.95,32.41 IC4.4
P0.13  (via drill 0.3)
  Top 0.305: IC1.39 24.25,25.55 v24.5,25.8 | v14.3,43.1 13.7,42.5 13.7,38.5 12.8,37.6 v12.8,36.45 | v20,46.65 20.65,47.3 CON5.P$2
  Bottom 0.305: v24.5,25.8 24.5,26.4 17.6,33.3 17.6,33.7 16.3,35 CON1.14 15.55,35 14.55,36 13.25,36 v12.8,36.45 | v14.3,43.1 14.65,43.45 18.45,43.45 20,45 v20,46.65
P0.14  (via drill 0.3)
  Top 0.305: IC1.41 v25.25,26.15 | v46.2,26.5 LOAD.1 | v16.35,41.5 16.35,42.1 18.7,44.45 v31.2,44.45
  Bottom 0.305: v25.25,26.15 25.25,26.5 18.2,33.55 18.2,34.2 16.4,36 15.5,36 14.5,37 CON1.15 15,38 15,39.15 16.35,40.5 v16.35,41.5 | R8.1 v46.2,26.5 46.2,26 45,24.8 C13.2 43.8,24.8 42,26.6 42,30.75 36.75,36 35.2,36 35,36.2 35,43.6 34.15,44.45 v31.2,44.45
P0.15  (via drill 0.3)
  Top 0.305: v26.6,26.6 27.25,25.95 IC1.45 | CON1.16 16,37.45 14.35,39.1 v14.35,42.2
  Bottom 0.305: v26.6,26.6 26,26.6 18.8,33.8 18.8,34.6 16.4,37 CON1.16 | v14.35,42.2 14.95,42.8 18.8,42.8 21,45 CON6.P$6
P0.16  (via drill 0.3)
  Top 0.305: IC1.46 27.75,26.2 27.45,26.5 v27.45,26.65 | CON5.P$3 22.65,47.3 v22,46.65
  Bottom 0.305: v27.45,26.65 26.85,27.25 26.2,27.25 19.4,34.05 19.4,36.1 17,38.5 17,40 CON2.1 | CON2.1 16.85,42.15 16,42.15 15.65,41.8 15.65,40.7 14.35,39.4 14.35,38.9 11.75,36.3 11.75,33.15 9.85,31.25 9.85,29.4 10.5,28.75 IC4.6 | v22,46.65 22,45 CON2.1
P0.17  (via drill 0.3)
  Top 0.305: IC1.47 28.25,26.1 v28.5,26.35
  Bottom 0.305: CON2.2 18,38.4 20,36.4 20,34.3 26.45,27.85 27.15,27.85 28.1,26.9 28.1,26.75 v28.5,26.35
P0.18  (via drill 0.3)
  Top 0.305: IC1.53 28.55,28.25 v28.15,28.65
  Bottom 0.305: CON2.3 19,40 19,38.4 20.6,36.8 20.6,35.1 23.2,32.5 23.6,32.5 27.05,29.05 27.75,29.05 v28.15,28.65
P0.19  (via drill 0.3)
  Top 0.305: IC1.54 29,28.75 v28.05,29.7
  Bottom 0.305: CON2.4 20,38.3 21.2,37.1 21.2,35.35 23.45,33.1 23.85,33.1 27.25,29.7 v28.05,29.7
P0.20  (via drill 0.3)
  Top 0.305: v29.05,29.65 29.45,29.25 IC1.55
  Bottom 0.305: v29.05,29.65 28.35,30.35 27.45,30.35 24.1,33.7 23.7,33.7 21.8,35.6 21.8,37.4 21,38.2 21,40 CON2.5
P0.21  (via drill 0.3)
  Top 0.305: v30.3,35.7 IC1.1
  Bottom 0.305: v30.3,35.7 30.3,32.6 29.25,31.55 27.95,31.55 22.4,37.1 22.4,38.6 CON2.6 22,39.45 23,40.45 CON6.P$5
P0.22  (via drill 0.3)
  Top 0.305: IC1.2 28.25,36.55 28.5,36.8 29.3,36.8 v29.6,36.5 | v24,46.65 24.65,47.3 CON5.P$4
  Bottom 0.305: v29.6,36.5 29.6,32.8 28.95,32.15 28.2,32.15 23,37.35 23,39.5 24,40.5 CON2.7 v24,46.65
P0.23  (via drill 0.3)
  Top 0.305: IC1.58 29.85,30.75 29.45,31.15 29.45,32.85 28.85,33.45 28.05,33.45 v27.95,33.35
  Bottom 0.305: v27.95,33.35 24,37.3 CON2.8
P0.25
  Top 0.305: CON2.10 26,38.6 24.75,37.35 IC1.9
  Bottom 0.305: CON2.10 26,39.5 25,40.5 CON6.P$4
P0.26  (via drill 0.3)
  Top 0.305: IC1.10 24.25,37.75 25,38.5 25,39.5 25.5,40 27,40 CON2.11 | v26,46.65 26.65,47.3 CON5.P$5
  Bottom 0.305: CON2.11 26,43 v26,46.65
P0.27  (via drill 0.3)
  Top 0.305: CON2.12 29,40 29,41.7 v28.9,41.8 28.7,42 23.45,42 23,41.55 23,38.4 23.75,37.65 IC1.11
  Bottom 0.305: CON6.P$3 27,43.7 v28.9,41.8
P0.28  (via drill 0.3)
  Top 0.305: IC1.13 22.75,37.55 22.3,38 21.5,38 21,38.5 21,41.5 22.1,42.6 29.05,42.6 30,41.65 CON2.13 | CON5.P$6 28.65,47.3 v28,46.65
  Bottom 0.305: v28,46.65 28,43.65 30,41.65 CON2.13
P0.29  (via drill 0.3)
  Top 0.305: IC1.14 22.25,37.05 21.9,37.4 20,37.4 19,38.4 19,41.5 20.7,43.2 29.5,43.2 v29.6,43.1 31,41.7 31,40 CON2.14
  Bottom 0.305: CON6.P$2 29,43.7 v29.6,43.1
P0.30  (via drill 0.3)
  Top 0.305: IC1.15 21.75,36.75 21.7,36.8 19.6,36.8 18.4,38 17.5,38 17,38.5 17,41.8 19,43.8 v30,43.8 32,41.8 CON2.15 32,41.45 | v30,46.65 30.65,47.3 CON5.P$7
  Bottom 0.305: v30,43.8 v30,46.65
P0.31  (via drill 0.3)
  Top 0.305: CON2.16 33.05,40.05 33.05,41.65 31.95,42.75 31.95,45.05 v31.25,45.75 17.2,45.75 16.95,46 15.4,46 15,45.6 15,40.85 15.65,40.2 v15.65,38.85 | IC1.17 19.3,35.2 v17.8,36.7
  Bottom 0.305: v17.8,36.7 v15.65,38.85 | v31.25,45.75 31,46 CON6.P$1
P1.16  (via drill 0.3)
  Top 0.305: IC1.16 19.8,35.7 18.1,37.4 17.1,37.4 16.35,38.15 16.35,40.45 15.65,41.15 15.65,44.5 LED2.A 16.25,45.1 v30.7,45.1
  Bottom 0.305: v30.7,45.1 34.45,45.1 35.65,43.9 35.65,37.35 CON3.1
P1.17  (via drill 0.3)
  Top 0.305: v24.1,34.4 23.7,34.4 23.25,34.85 IC1.12 | v31.8,36.7 33.7,36.7 CON3.2 | v34,43.65 34,44.85 LED3.A
  Bottom 0.305: v24.1,34.4 24.25,34.4 27.7,30.95 29.55,30.95 31.2,32.6 31.2,34.15 31.8,34.75 v31.8,36.7 | CON3.2 v34,43.65
P1.18  (via drill 0.3)
  Top 0.305: IC1.8 25.25,36.95 26.3,38 v27,38 | B1.1 v46.2,20.15
  Bottom 0.305: v27,38 31.4,38 33.4,36 34.45,36 35.45,35 CON3.3 36.75,35 40.15,31.6 40.15,26.2 C14.2 45.05,21.85 46.2,20.7 v46.2,20.15 R9.1
P1.19
  Top 0.305: CON3.4 29.45,35 29.05,34.6 27.4,34.6 27.25,34.75 IC1.4
P1.20  (via drill 0.3)
  Top 0.305: v29.3,25.35 28.75,24.8 IC1.48
  Bottom 0.305: v29.3,25.35 30,26.05 30,28.7 33.3,32 35,32 CON3.5
P1.21  (via drill 0.3)
  Top 0.305: IC1.44 26.75,25.55 v26.55,25.75
  Bottom 0.305: v26.55,25.75 26.8,25.5 28.55,25.5 29.4,26.35 29.4,29.1 33.3,33 CON3.6
P1.22  (via drill 0.3)
  Top 0.305: IC1.40 24.75,23.35 v24.99,23.11
  Bottom 0.305: v24.99,23.11 29.76,23.11 31.2,24.55 31.2,27.9 33.3,30 34.55,30 35.55,31 CON3.7
P1.23  (via drill 0.3)
  Top 0.305: IC1.36 v22.75,23.11
  Bottom 0.305: CON3.8 33.3,31 30.6,28.3 30.6,24.85 29.5,23.75 23.39,23.75 v22.75,23.11
P1.24  (via drill 0.3)
  Top 0.305: v20.05,24.45 19,24.45 16.7,22.15 v16.7,19.85 | IC1.32 19.8,25.75 v19.8,25.73
  Bottom 0.305: CON3.9 35.5,29 34.5,28 33.4,28 32.4,27 32.4,23.95 30.45,22 22.05,22 21.5,22.55 21.5,23 v20.05,24.45 19.8,24.7 v19.8,25.73 | IC2.7 24.21,6.37 22.15,4.3 19.3,4.3 16.7,6.9 v16.7,19.85
P1.25  (via drill 0.3)
  Top 0.305: IC1.28 20.15,28.25 20.5,27.9 v20.5,27 | U$3.21 35.48,3.88 35.6,3.75 36.55,3.75 v39.45,6.65 | v37.95,30 v39.45,28.5
  Bottom 0.305: v20.5,27 20.5,24.9 22.1,23.3 22.1,22.8 22.4,22.5 30.05,22.5 31.8,24.25 31.8,27.6 33.2,29 CON3.10 34.45,29 35.45,30 v37.95,30 | v39.45,6.65 v39.45,28.5
P1.26  (via drill 0.3)
  Top 0.305: v29.4,24.55 29.4,23.4 29,23 29,18.45 30.2,17.25 36.2,17.25 v38,19.05 | v22.4,25.9 22.4,28.7 20.85,30.25 IC1.24 | U$3.22 35.17,3.23 35.3,3.1 36.95,3.1 v38,4.15
  Bottom 0.305: v29.4,24.55 23.15,24.55 22.4,25.3 v22.4,25.9 | CON3.11 38,25 v38,19.05 v38,4.15
P1.27  (via drill 0.3)
  Top 0.305: v31.9,33.75 IC1.64 | v38.75,8.75 36.48,6.47 U$3.17
  Bottom 0.305: v31.9,33.75 32.15,34 36.65,34 38.75,31.9 38.75,28 | CON3.12 34.5,27 35.5,28 38.75,28 | 38.75,28 v38.75,8.75
P1.28  (via drill 0.3)
  Top 0.305: IC1.60 32.25,31.75 32.5,32 36.5,32 37.15,31.35 37.15,26.15 CON3.13 | v37.25,8.2 36.17,7.12 U$3.16
  Bottom 0.305: v37.25,8.2 37.25,24.2 36.45,25 CON3.13
P1.29  (via drill 0.3)
  Top 0.305: IC1.56 31.6,29.75 33,28.35 33,26 CON3.14 | U1.5 30.22,11.47 31.9,13.15 v33.9,13.15
  Bottom 0.305: CON3.14 35,24 35,21.25 33.9,20.15 v33.9,13.15
P1.30  (via drill 0.3)
  Top 0.305: IC1.52 31.65,27.75 32.4,27 32.4,25.1 33.5,24 34.5,24 35.5,23 CON3.15 | U1.7 24.19,13.2 31.1,13.2 31.7,13.8 36.1,13.8 v36.3,14
  Bottom 0.305: v36.3,14 36.3,22.7 CON3.15
P1.31  (via drill 0.3)
  Top 0.305: v31.65,22.2 30.1,23.75 30.1,25.45 29.4,26.15 29.4,26.45 v28.75,27.1 | v23.65,31.55 22.95,32.25 IC1.20 | U1.6 26.68,13.85 30.9,13.85 v33,15.95
  Bottom 0.305: v28.75,27.1 27.4,28.45 26.75,28.45 v23.65,31.55 | 33,22.2 v31.65,22.2 | 33,22.2 33.8,23 CON3.16 | v33,15.95 33,22.2
RESET  (via drill 0.3)
  Top 0.305: IC1.57 29.55,30.25 28.6,31.2 v28.6,32.8 | C12.2 v42.7,38.45 38.15,38.45 37.35,39.25 36.19,39.25 RESET.1 34.5,40.5 v33.25,39.25 | v24.55,40 25.55,41 CON2.9
  Bottom 0.305: v28.6,32.8 28.6,33.6 25,37.2 25,39.55 v24.55,40 | CON2.9 27,40 32.5,40 v33.25,39.25 | v42.7,38.45 C12.2
RTXC1
  Top 0.305: IC1.3 27.75,36.85 28.3,37.4 32.9,37.4 33.5,38 36.85,38 37.1,37.75 37.1,36.85 37.75,36.2 39.72,36.2 Q2.2
  Bottom 0.305: C10.1 40.15,37.87 Q2.2
RTXC2
  Top 0.305: IC1.5 26.75,36.65 28.1,38 32.6,38 33.2,38.6 37.1,38.6 38.23,37.47 Q2.1
  Bottom 0.305: C11.1 37.65,37.83 Q2.1
STBY
  Top 0.305: Q3.2 41.5,10.55 40.3,9.35 40.3,8.45 37.02,5.17 U$3.19
VBAT  (via drill 0.5)
  Top 0.813: v4.1,14 4.1,18.77 U$1.3
  Bottom 0.813: F3.1 v4.1,14
VBAT2  (via drill 0.5)
  Top 0.813: J1.1 v2.5,9.85
  Bottom 0.813: F3.2 v2.5,9.85 4.05,9.85 5.97,11.77 L2.1
VCC  (via drill 0.6)
  Top 0.305: U$3.13 34.34,8.75 U$3.14
  Top 0.406: U$3.24 33.12,1.93 32.25,2.8 32.25,5.2 C4.1
  Top 1.016: 28.35,7.5 30.7,7.5 | 30.7,7.5 31.85,7.5 33.1,8.75 34.34,8.75 | C3.1 28.35,7.5 | C4.1 30.7,7.5 | 28.35,7.5 19.7,7.5 18.75,8.45 v18,8.45 15.4,8.45 14.85,9 v10.9,9 | CON4.13 CON4.15 | CON4.14 CON4.13 | CON4.13 CON4.11 CON4.12
  Bottom 1.016: v18,8.45 CON4.15 CON4.16 | v10.9,9 10.9,16.51 F1.2 9.71,20.94 R5.2
VD+
  Top 0.305: U$3.12 41.66,8.75 U$3.11
  Top 1.016: 41.66,8.75 43.5,8.75 MD.2
VD-
  Top 0.305: U$3.8 41.66,6.15 U$3.7
  Top 1.016: 41.66,6.15 42.75,6.15 43.45,5.45 43.45,4.6 45.8,2.25 MD.1
VDD  (via drill 0.5)
  Top 0.61: v3.1,35.75 1.5,34.15 1.5,18.88 U$1.2
  Bottom 0.61: U$2.4 5.25,36.25 R3.2 3.2,35.85 v3.1,35.75 C1.1
VI+  (via drill 0.3)
  Top 0.305: U$3.2 41.66,2.25 U$3.1
  Top 1.016: 41.66,2.25 v40.05,2.25
  Bottom 1.016: MI.1 4.05,5.75 7.3,2.5 39.15,2.5 v39.4,2.25
  other vias: 39.4,2.9 40.05,2.9
  pour Bottom: 39,3.3 39,1.85 40.45,1.85 40.45,3.3
  pour Top: 39,3.3 40.45,3.3 40.45,1.85 39,1.85
VI-  (via drill 0.3)
  Top 0.305: U$3.6 41.66,4.85 U$3.5
  Top 1.016: 41.66,4.85 40.05,4.85 v40.05,4.95
  Bottom 1.016: MI.2 5.4,0.85 40.9,0.85 41.35,1.3 41.35,3.75 40.8,4.3 v40.05,4.3
  other vias: 39.4,4.95 39.4,4.3
  pour Top: 39,5.35 40.45,5.35 40.45,3.9 39,3.9
  pour Bottom: 39,5.35 39,3.9 40.45,3.9 40.45,5.35
VRTC
  Top 0.305: CON4.3 31,20 32.5,20 33,20.5 33,21.85 30.7,24.15 IC1.49
  Bottom 0.813: CON4.5 CON4.3
VUSB
  Top 0.813: JP1.4 14.42,7.15 F2.2
XTAL1
  Top 0.305: IC1.62 32.2,32.75 33.45,34 38.05,34 C9.2

### Text on the board
tPlace: RESAJ | BAT | GND | VRTC | 3V3 | + | + | GND | - | -
bPlace: RESAJ